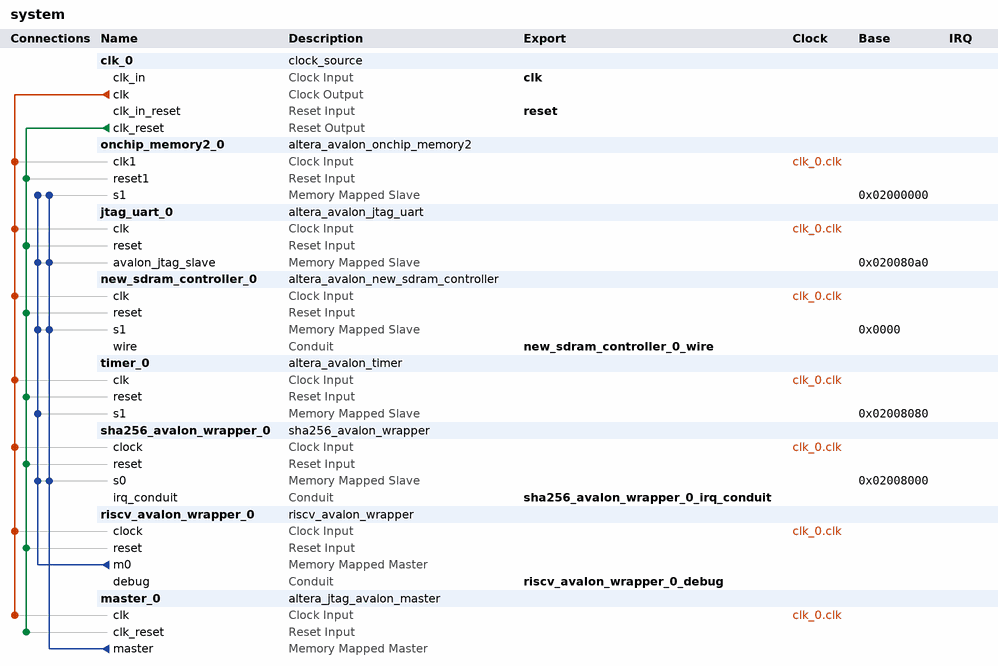
[diagram p0: system contents]
# Platform Designer (Qsys) system system, Cyclone IV E EP4CE22F17C6
# Parameters at their usual value, and those the tool derives, are not listed.
package require -exact qsys 13.0.1.99.2
create_system system
set_project_property DEVICE_FAMILY {Cyclone IV E}
set_project_property DEVICE EP4CE22F17C6

add_instance clk_0 clock_source 13.0
set_instance_parameter_value clk_0 clockFrequency 50000000

add_instance onchip_memory2_0 altera_avalon_onchip_memory2 13.0.1.99.2
set_instance_parameter_value onchip_memory2_0 dataWidth 32
set_instance_parameter_value onchip_memory2_0 dualPort false
set_instance_parameter_value onchip_memory2_0 initMemContent true
set_instance_parameter_value onchip_memory2_0 initializationFileName onchip_mem.hex
set_instance_parameter_value onchip_memory2_0 memorySize 30000

add_instance jtag_uart_0 altera_avalon_jtag_uart 13.0.1.99.2
set_instance_parameter_value jtag_uart_0 simInteractiveOptions NO_INTERACTIVE_WINDOWS

add_instance new_sdram_controller_0 altera_avalon_new_sdram_controller 13.0.1.99.2
set_instance_parameter_value new_sdram_controller_0 TAC 5.5
set_instance_parameter_value new_sdram_controller_0 TRCD 20.0
set_instance_parameter_value new_sdram_controller_0 TRP 20.0
set_instance_parameter_value new_sdram_controller_0 casLatency 3
set_instance_parameter_value new_sdram_controller_0 columnWidth 9
set_instance_parameter_value new_sdram_controller_0 dataWidth 16
set_instance_parameter_value new_sdram_controller_0 generateSimulationModel false
set_instance_parameter_value new_sdram_controller_0 model single_Micron_MT48LC4M32B2_7_chip
set_instance_parameter_value new_sdram_controller_0 numberOfBanks 4
set_instance_parameter_value new_sdram_controller_0 numberOfChipSelects 1
set_instance_parameter_value new_sdram_controller_0 powerUpDelay 100.0
set_instance_parameter_value new_sdram_controller_0 refreshPeriod 15.625
set_instance_parameter_value new_sdram_controller_0 rowWidth 13

add_instance timer_0 altera_avalon_timer 13.0.1.99.2
set_instance_parameter_value timer_0 period 1
set_instance_parameter_value timer_0 periodUnits MSEC

add_instance sha256_avalon_wrapper_0 sha256_avalon_wrapper 1.0

add_instance riscv_avalon_wrapper_0 riscv_avalon_wrapper 1.0

add_instance master_0 altera_jtag_avalon_master 13.0

# connections
add_connection clk_0.clk jtag_uart_0.clk clock
add_connection clk_0.clk master_0.clk clock
add_connection clk_0.clk new_sdram_controller_0.clk clock
add_connection clk_0.clk onchip_memory2_0.clk1 clock
add_connection clk_0.clk riscv_avalon_wrapper_0.clock clock
add_connection clk_0.clk sha256_avalon_wrapper_0.clock clock
add_connection clk_0.clk timer_0.clk clock
add_connection clk_0.clk_reset jtag_uart_0.reset reset
add_connection clk_0.clk_reset master_0.clk_reset reset
add_connection clk_0.clk_reset new_sdram_controller_0.reset reset
add_connection clk_0.clk_reset onchip_memory2_0.reset1 reset
add_connection clk_0.clk_reset riscv_avalon_wrapper_0.reset reset
add_connection clk_0.clk_reset sha256_avalon_wrapper_0.reset reset
add_connection clk_0.clk_reset timer_0.reset reset
add_connection master_0.master jtag_uart_0.avalon_jtag_slave avalon
set_connection_parameter_value master_0.master/jtag_uart_0.avalon_jtag_slave baseAddress 0x020080a0
add_connection master_0.master new_sdram_controller_0.s1 avalon
set_connection_parameter_value master_0.master/new_sdram_controller_0.s1 baseAddress 0x0000
add_connection master_0.master onchip_memory2_0.s1 avalon
set_connection_parameter_value master_0.master/onchip_memory2_0.s1 baseAddress 0x02000000
add_connection master_0.master sha256_avalon_wrapper_0.s0 avalon
set_connection_parameter_value master_0.master/sha256_avalon_wrapper_0.s0 baseAddress 0x02008000
add_connection riscv_avalon_wrapper_0.m0 jtag_uart_0.avalon_jtag_slave avalon
set_connection_parameter_value riscv_avalon_wrapper_0.m0/jtag_uart_0.avalon_jtag_slave baseAddress 0x020080a0
add_connection riscv_avalon_wrapper_0.m0 new_sdram_controller_0.s1 avalon
set_connection_parameter_value riscv_avalon_wrapper_0.m0/new_sdram_controller_0.s1 baseAddress 0x0000
add_connection riscv_avalon_wrapper_0.m0 onchip_memory2_0.s1 avalon
set_connection_parameter_value riscv_avalon_wrapper_0.m0/onchip_memory2_0.s1 baseAddress 0x02000000
add_connection riscv_avalon_wrapper_0.m0 sha256_avalon_wrapper_0.s0 avalon
set_connection_parameter_value riscv_avalon_wrapper_0.m0/sha256_avalon_wrapper_0.s0 baseAddress 0x02008000
add_connection riscv_avalon_wrapper_0.m0 timer_0.s1 avalon
set_connection_parameter_value riscv_avalon_wrapper_0.m0/timer_0.s1 baseAddress 0x02008080

# exported interfaces
add_interface clk clock sink
set_interface_property clk EXPORT_OF clk_0.clk_in
add_interface reset reset sink
set_interface_property reset EXPORT_OF clk_0.clk_in_reset
add_interface new_sdram_controller_0_wire conduit end
set_interface_property new_sdram_controller_0_wire EXPORT_OF new_sdram_controller_0.wire
add_interface riscv_avalon_wrapper_0_debug conduit end
set_interface_property riscv_avalon_wrapper_0_debug EXPORT_OF riscv_avalon_wrapper_0.debug
add_interface sha256_avalon_wrapper_0_irq_conduit conduit end
set_interface_property sha256_avalon_wrapper_0_irq_conduit EXPORT_OF sha256_avalon_wrapper_0.irq_conduit

set_interconnect_requirement {$system} qsys_mm.clockCrossingAdapter HANDSHAKE
set_interconnect_requirement {$system} qsys_mm.maxAdditionalLatency 1

save_system system.qsys
